# Altium schematic sheet 0.SchDoc
size A4
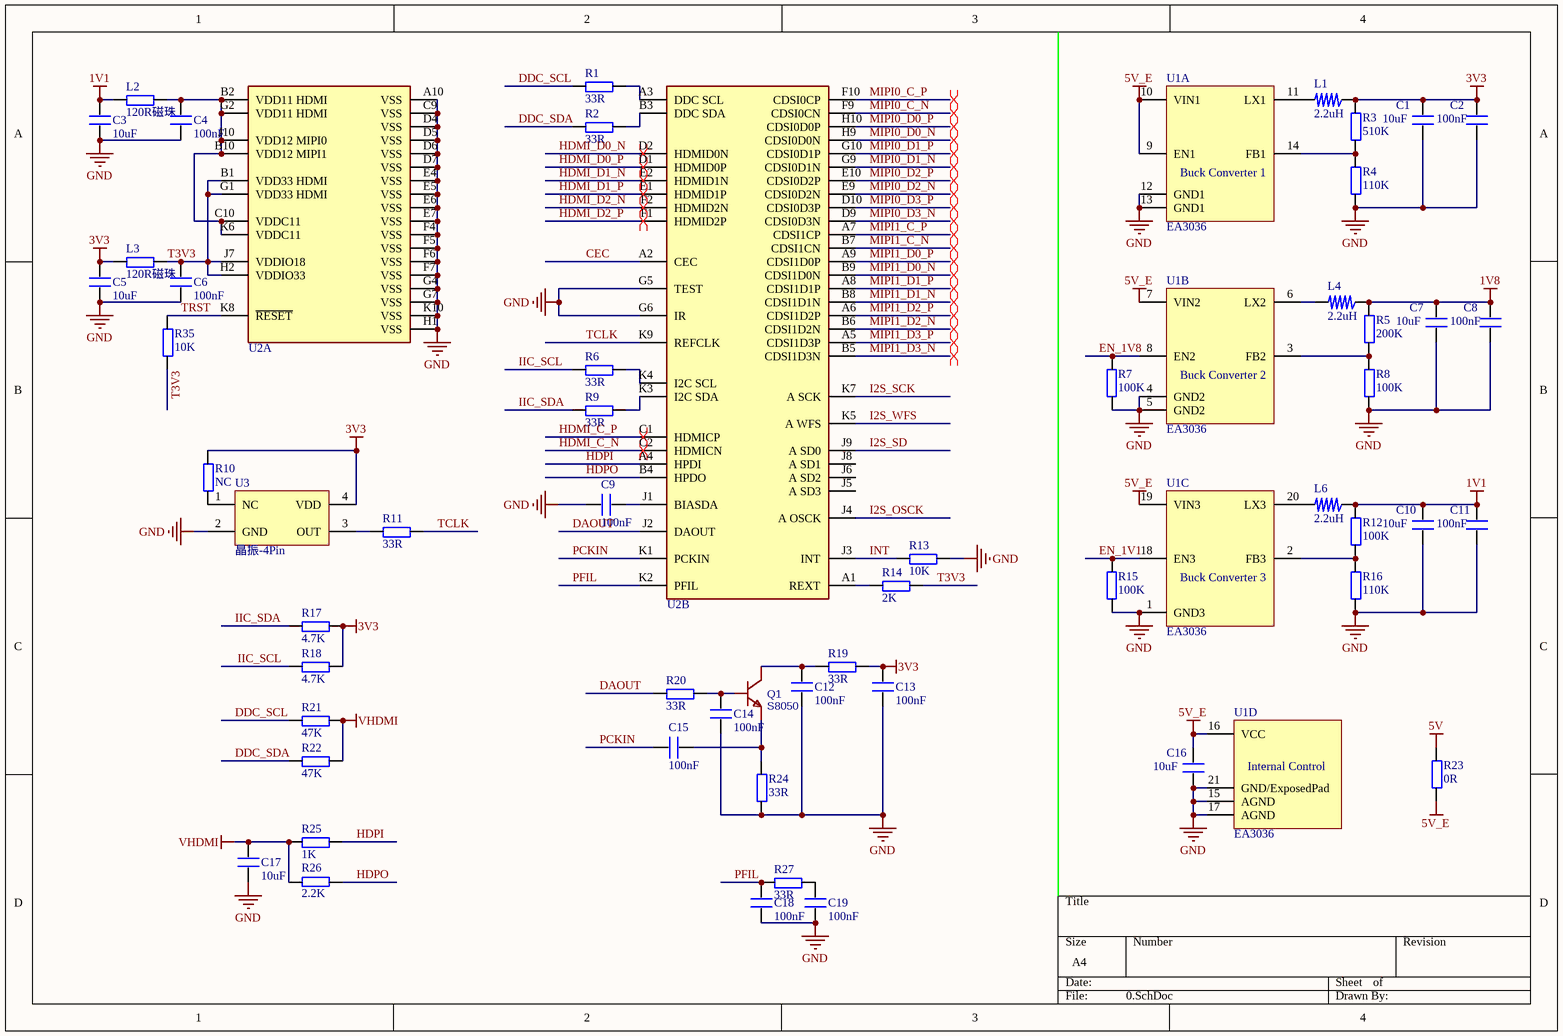
[diagram p0: 0.SchDoc]

## Parts
C1  10uF  [0603_CAP]
C2  100nF  [0603_CAP]
C3  10uF  [0603_CAP]
C4  100nF  [0603_CAP]
C5  10uF  [0603_CAP]
C6  100nF  [0603_CAP]
C7  10uF  [0603_CAP]
C8  100nF  [0603_CAP]
C9  100nF  [0603_CAP]
C10  10uF  [0603_CAP]
C11  100nF  [0603_CAP]
C12  100nF  [0603_CAP]
C13  100nF  [0603_CAP]
C14  100nF  [0603_CAP]
C15  100nF  [0603_CAP]
C16  10uF  [0603_CAP]
C17  10uF  [0603_CAP]
C18  100nF  [0603_CAP]
C19  100nF  [0603_CAP]
L1  2.2uH  [2520-L]
L2  120R磁珠  [0603_RES]
L3  120R磁珠  [0603_RES]
L4  2.2uH  [2520-L]
L6  2.2uH  [2520-L]
Q1  S8050  [SOT-23-3_L2.9-W1.3-P1.90-LS2.4-BR]
R1  33R  [0603_RES]
R2  33R  [0603_RES]
R3  510K  [0603_RES]
R4  110K  [0603_RES]
R5  200K  [0603_RES]
R6  33R  [0603_RES]
R7  100K  [0603_RES]
R8  100K  [0603_RES]
R9  33R  [0603_RES]
R10  NC  [0603_RES]
R11  33R  [0603_RES]
R12  100K  [0603_RES]
R13  10K  [0603_RES]
R14  2K  [0603_RES]
R15  100K  [0603_RES]
R16  110K  [0603_RES]
R17  4.7K  [0603_RES]
R18  4.7K  [0603_RES]
R19  33R  [0603_RES]
R20  33R  [0603_RES]
R21  47K  [0603_RES]
R22  47K  [0603_RES]
R23  0R  [0603_RES]
R24  33R  [0603_RES]
R25  1K  [0603_RES]
R26  2.2K  [0603_RES]
R27  33R  [0603_RES]
R35  10K  [0603_RES]
U1  EA3036  [QFN-20]  (parts A,B,C,D of 4)
U2  TC358870XBG  [BGA80_7*7_TC358870XBG]  (value not drawn)  (parts A,B of 2)
U3  晶振-4Pin  [晶振2520]

## Nets
1V1: C3.1 C10.2 C11.2 L2.1 L6.1 R12.2
1V8: C7.2 C8.2 L4.1 R5.2
3V3: C1.2 C2.2 C5.1 C13.2 L1.1 L3.1 R3.2 R10.2 R17.2 R18.2 R19.2 U3.4(VDD)
5V: R23.2
5V_E: C16.2 R23.1 U1.7(VIN2) U1.9(EN1) U1.10(VIN1) U1.16(VCC) U1.19(VIN3)
GND: C1.1 C2.1 C3.2 C4.2 C5.2 C6.2 C7.1 C8.1 C9.1 C10.1 C11.1 C12.1 C13.1 C14.1 C16.1 C17.1 C18.1 C19.1 R4.1 R7.2 R8.1 R13.2 R15.2 R16.1 R24.1 U1.1(GND3) U1.4(GND2) U1.5(GND2) U1.12(GND1) U1.13(GND1) U1.15(AGND) U1.17(AGND) U1.21(GND/ExposedPad) U2.A10(VSS) U2.C9(VSS) U2.D4(VSS) U2.D5(VSS) U2.D6(VSS) U2.D7(VSS) U2.E4(VSS) U2.E5(VSS) U2.E6(VSS) U2.E7(VSS) U2.F4(VSS) U2.F5(VSS) U2.F6(VSS) U2.F7(VSS) U2.G4(VSS) U2.G5(TEST) U2.G6(IR) U2.G7(VSS) U2.H1(VSS) U2.K10(VSS) U3.2(GND)
VHDMI: C17.2 R21.2 R22.2 R25.1 R26.2
CEC: U2.A2(CEC)
DAOUT: R20.1 U2.J2(DAOUT)
DDC_SCL: R1.1 R21.1
DDC_SDA: R2.1 R22.1
EN_1V1: R15.1 U1.18(EN3)
EN_1V8: R7.1 U1.8(EN2)
HDMI_C_N: U2.C2(HDMICN)
HDMI_C_P: U2.C1(HDMICP)
HDMI_D0_N: U2.D2(HDMID0N)
HDMI_D0_P: U2.D1(HDMID0P)
HDMI_D1_N: U2.E2(HDMID1N)
HDMI_D1_P: U2.E1(HDMID1P)
HDMI_D2_N: U2.F2(HDMID2N)
HDMI_D2_P: U2.F1(HDMID2P)
HDPI: R25.2 U2.A4(HPDI)
HDPO: R26.1 U2.B4(HPDO)
I2S_OSCK: U2.J4(A_OSCK)
I2S_SCK: U2.K7(A_SCK)
I2S_SD: U2.J9(A_SD0)
I2S_WFS: U2.K5(A_WFS)
IIC_SCL: R6.1 R18.1
IIC_SDA: R9.1 R17.1
INT: R13.1 U2.J3(INT)
MIPI0_C_N: U2.F9(CDSI0CN)
MIPI0_C_P: U2.F10(CDSI0CP)
MIPI0_D0_N: U2.H9(CDSI0D0N)
MIPI0_D0_P: U2.H10(CDSI0D0P)
MIPI0_D1_N: U2.G9(CDSI0D1N)
MIPI0_D1_P: U2.G10(CDSI0D1P)
MIPI0_D2_N: U2.E9(CDSI0D2N)
MIPI0_D2_P: U2.E10(CDSI0D2P)
MIPI0_D3_N: U2.D9(CDSI0D3N)
MIPI0_D3_P: U2.D10(CDSI0D3P)
MIPI1_C_N: U2.B7(CDSI1CN)
MIPI1_C_P: U2.A7(CDSI1CP)
MIPI1_D0_N: U2.B9(CDSI1D0N)
MIPI1_D0_P: U2.A9(CDSI1D0P)
MIPI1_D1_N: U2.B8(CDSI1D1N)
MIPI1_D1_P: U2.A8(CDSI1D1P)
MIPI1_D2_N: U2.B6(CDSI1D2N)
MIPI1_D2_P: U2.A6(CDSI1D2P)
MIPI1_D3_N: U2.B5(CDSI1D3N)
MIPI1_D3_P: U2.A5(CDSI1D3P)
PCKIN: C15.2 U2.K1(PCKIN)
PFIL: C18.2 R27.1 U2.K2(PFIL)
T3V3: C6.1 L3.2 R14.2 R35.1 U2.B1(VDD33_HDMI) U2.G1(VDD33_HDMI) U2.H2(VDDIO33) U2.J7(VDDIO18)
TCLK: R11.2 U2.K9(REFCLK)
TRST: R35.2 U2.K8(~{RESET})
NetC4_1: C4.1 L2.2 U2.B2(VDD11_HDMI) U2.B10(VDD12_MIPI1) U2.C10(VDDC11) U2.G2(VDD11_HDMI) U2.J10(VDD12_MIPI0) U2.K6(VDDC11)
NetC9_2: C9.2 U2.J1(BIASDA)
NetC12_2: C12.2 Q1.3(C) R19.1
NetC14_2: C14.2 Q1.1(B) R20.2
NetC15_1: C15.1 Q1.2(E) R24.2
NetC19_2: C19.2 R27.2
NetL1_2: L1.2 U1.11(LX1)
NetL4_2: L4.2 U1.6(LX2)
NetL6_2: L6.2 U1.20(LX3)
NetR1_2: R1.2 U2.A3(DDC_SCL)
NetR2_2: R2.2 U2.B3(DDC_SDA)
NetR3_1: R3.1 R4.2 U1.14(FB1)
NetR5_1: R5.1 R8.2 U1.3(FB2)
NetR6_2: R6.2 U2.K4(I2C_SCL)
NetR9_2: R9.2 U2.K3(I2C_SDA)
NetR10_1: R10.1 U3.1(NC)
NetR11_1: R11.1 U3.3(OUT)
NetR12_1: R12.1 R16.2 U1.2(FB3)
NetR14_1: R14.1 U2.A1(REXT)

Not connected (* = marked no-connect by the designer): U2 J5(A_SD3) J6(A_SD2) J8(A_SD1)

## Layout directives
differential pair: HDMI_C_N, HDMI_C_P, HDMI_D0_N, HDMI_D0_P, HDMI_D1_N, HDMI_D1_P, HDMI_D2_N, HDMI_D2_P, MIPI0_C_N, MIPI0_C_P, MIPI0_D0_N, MIPI0_D0_P, MIPI0_D1_N, MIPI0_D1_P, MIPI0_D2_N, MIPI0_D2_P, MIPI0_D3_N, MIPI0_D3_P, MIPI1_C_N, MIPI1_C_P, MIPI1_D0_N, MIPI1_D0_P, MIPI1_D1_N, MIPI1_D1_P, MIPI1_D2_N, MIPI1_D2_P, MIPI1_D3_N, MIPI1_D3_P

## Notes on the sheet
- (in symbol EA3036, part A) Buck Converter 1
- (in symbol EA3036, part B) Buck Converter 2
- (in symbol EA3036, part C) Buck Converter 3
- (in symbol EA3036, part D) Internal Control

## Library data of the parts
C1-C19 = C
L1 L4 L6 = L_SOP
L2 L3 R1-R27 R35 = R
Q1 = S8050_C779775: BOM_Manufacturer: ZRE; Contributor: LCSC; BOM_Supplier: LCSC; BOM_Supplier Part: C779775; BOM_Manufacturer Part: S8050; spicePre: Q; spiceSymbolName: S8050_C779775
U1 = EA3036: EA3036 is a 3CH power management IC for applications powered by one Li-Ion battery or a DC 5V adapter.
U3 = 晶振-4Pin: 5032 有源